# EAGLE schematic PR8004 (EAGLE 6.6.0)
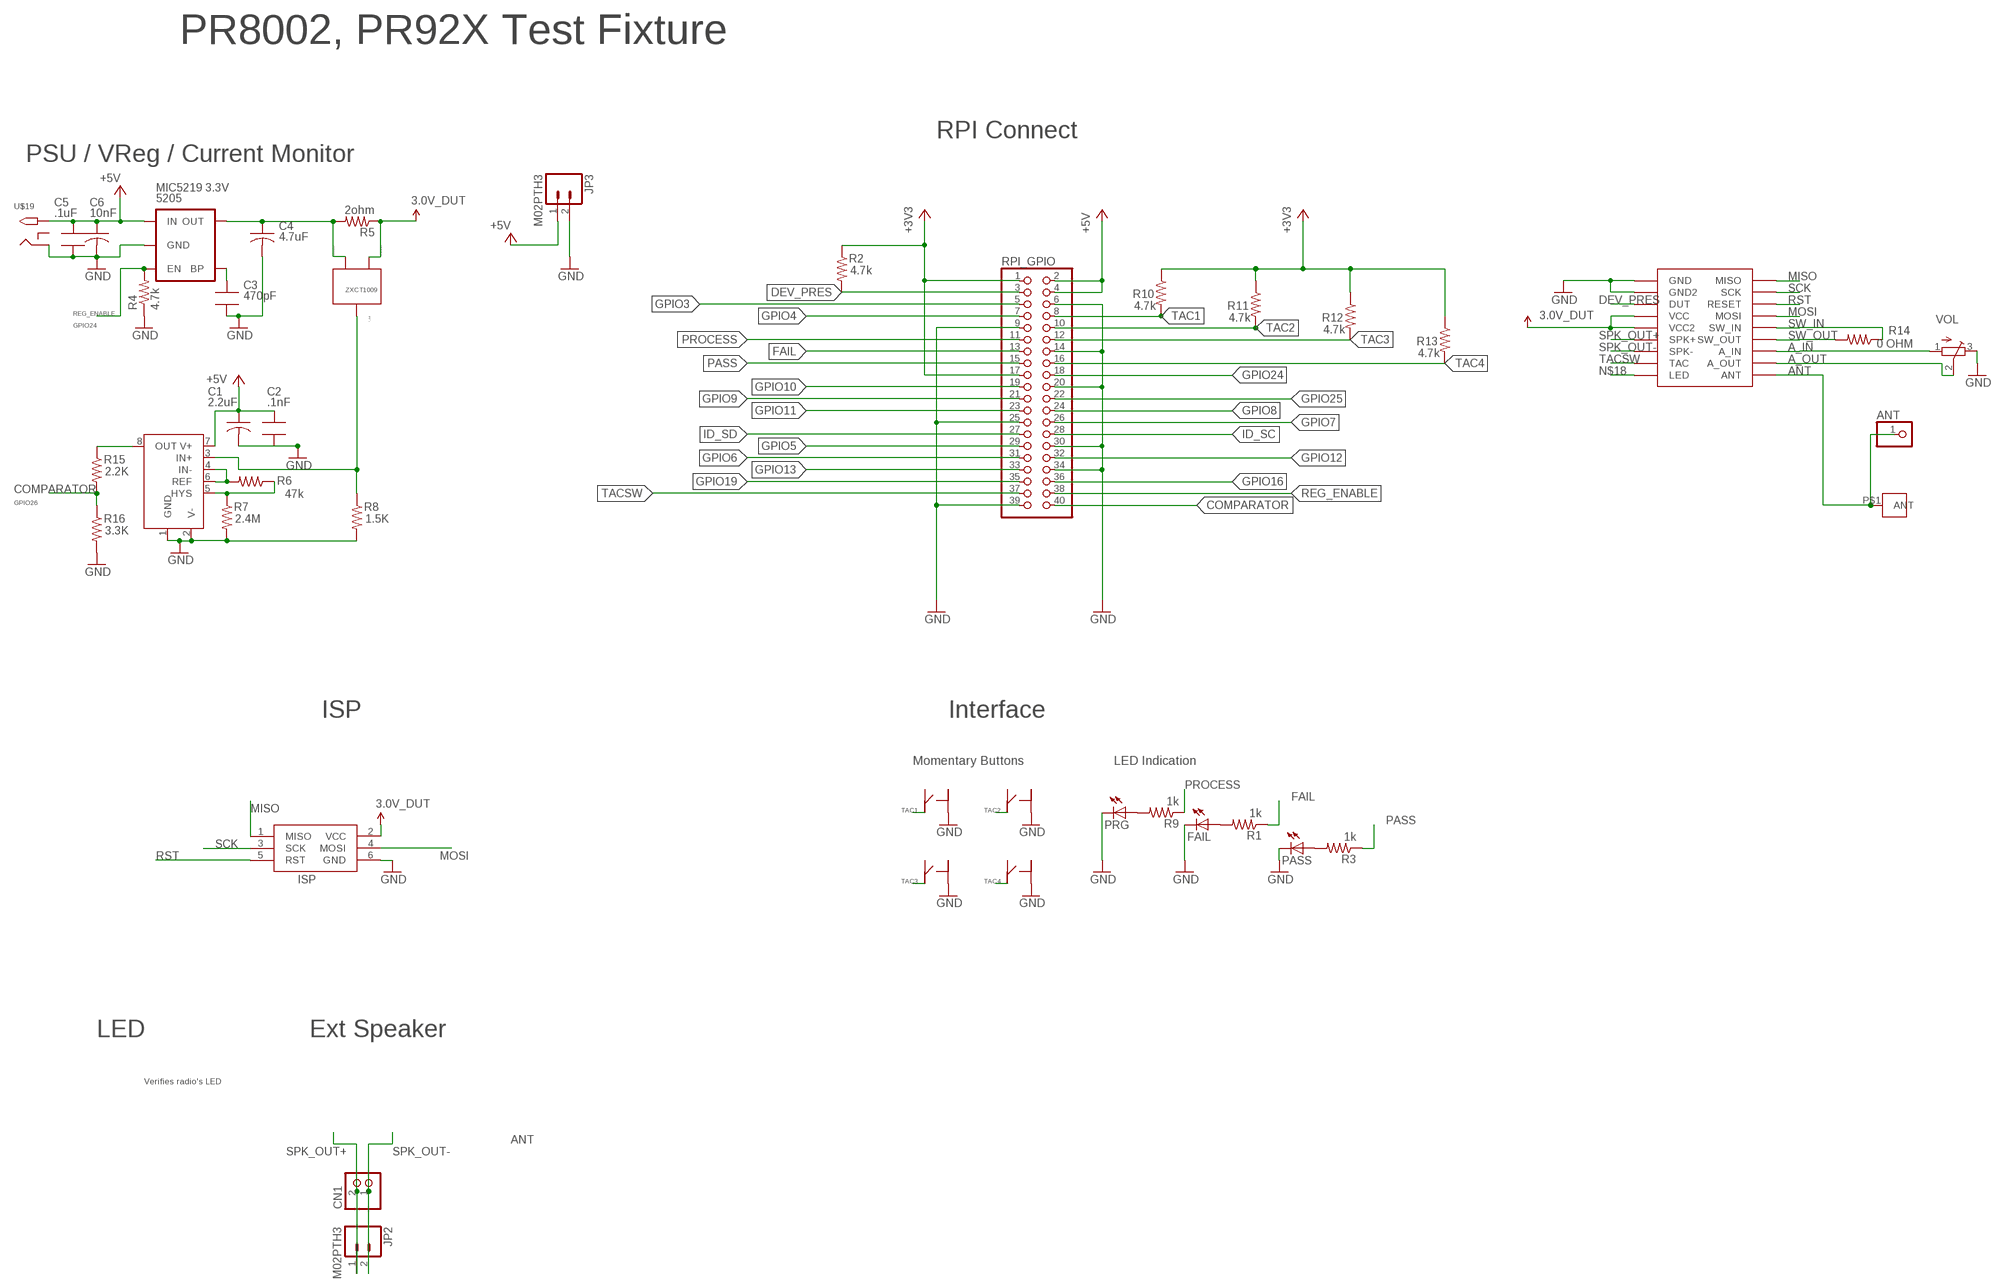
[diagram p0: schematic, sheet 1]

## Parts
5205  MIC5219 3.3V  V_REG_MIC52193.3V  [SOT23-5]
ANT  PINHD-1X1  [1X01]
C1  2.2uF  C-USC0805  [C0805]
C2  .1nF  C_SMT_0805_ADAFRUIT  [0805_ADAFRUIT]
C3  470pF  C_SMT_0805_ADAFRUIT  [0805_ADAFRUIT]
C4  4.7uF  C-USC0805  [C0805]
C5  .1uF  C_SMT_0805_ADAFRUIT  [0805_ADAFRUIT]
C6  10nF  C-USC0805  [C0805]
CN1  JST_2PIN-SMT-RA  [JST-B2B-PH-SM4-TB]
FAIL  LEDCHIP-LED0805  [CHIP-LED0805]
ISP  AVRISP-6  [AVRISP]
J1  M3_SCREW_POST  [M3_BOLT_HOLE]
JP2  M02PTH3  [1X02_LONGPADS]
JP3  M02PTH3  [1X02_LONGPADS]
PASS  LEDCHIP-LED0805  [CHIP-LED0805]
PRG  LEDCHIP-LED0805  [CHIP-LED0805]
R1  1k  R_SMT_0805_ADAFRUIT  [0805_ADAFRUIT]
R2  4.7k  R_SMT_0805_ADAFRUIT  [0805_ADAFRUIT]
R3  1k  R_SMT_0805_ADAFRUIT  [0805_ADAFRUIT]
R4  4.7k  R_SMT_0805_ADAFRUIT  [0805_ADAFRUIT]
R5  2ohm  R_SMT_0805_ADAFRUIT  [0805_ADAFRUIT]
R6  47k  R_SMT_0805_ADAFRUIT  [0805_ADAFRUIT]
R7  2.4M  R_SMT_0805_ADAFRUIT  [0805_ADAFRUIT]
R8  1.5K  R_SMT_0805_ADAFRUIT  [0805_ADAFRUIT]
R9  1k  R_SMT_0805_ADAFRUIT  [0805_ADAFRUIT]
R10  4.7k  R_SMT_0805_ADAFRUIT  [0805_ADAFRUIT]
R11  4.7k  R_SMT_0805_ADAFRUIT  [0805_ADAFRUIT]
R12  4.7k  R_SMT_0805_ADAFRUIT  [0805_ADAFRUIT]
R13  4.7k  R_SMT_0805_ADAFRUIT  [0805_ADAFRUIT]
R14  0 OHM  R_SMT_0805_ADAFRUIT  [0805_ADAFRUIT]
R15  2.2K  R_SMT_0805_ADAFRUIT  [0805_ADAFRUIT]
R16  3.3K  R_SMT_0805_ADAFRUIT  [0805_ADAFRUIT]
RPI_GPIO  PINHD-2X20  [2X20]
TSM931  TSM931  [MSOP8]
U$19  2.1MMJACKTHM  [PJ-102A]
U$20  C&K_PTS645  [C&K_PTS645_SMT]
U$22  C&K_PTS645  [C&K_PTS645_SMT]
U$23  C&K_PTS645  [C&K_PTS645_SMT]
U$24  C&K_PTS645  [C&K_PTS645_SMT]
U$26  PR9020_TESTPOINTS  [PR9020_TESTPOINTS]
VOL  TRIMPOTTC33X  [TC33X]
ZXCT  ZXCT1009  [SOT23]

## Nets
3.3V: ISP.2(VCC) R5.1 U$26.P$4(VCC) U$26.P$5(VCC2) ZXCT.1(VSENSE+) ; supply symbol labelled 3.0V_DUT
+3V3: R2.1 R10.1 R11.1 R12.1 R13.1 RPI_GPIO.1 RPI_GPIO.17
+5V: 5205.1(IN) C1.1 C2.1 C5.1 C6.1 JP3.1 RPI_GPIO.2 RPI_GPIO.4 TSM931.7(V+) U$19.TIP
A_IN: U$26.P$16(A_IN) VOL.1(A)
A_OUT: U$26.P$17(A_OUT) VOL.2(S)
ANT: ANT.1 J1.P$1(ANT) U$26.P$18(ANT)
COMPARATOR: R15.2 R16.1 RPI_GPIO.40
DEV_PRES: R2.2 RPI_GPIO.3 U$26.P$3(DUT)
FAIL: R1.1 RPI_GPIO.13
GND: 5205.2(GND) C1.2 C2.2 C3.2 C4.2 C5.2 C6.2 FAIL.C ISP.6(GND) JP3.2 PASS.C PRG.C R4.1 R7.2 R8.2 R16.2 RPI_GPIO.6 RPI_GPIO.9 RPI_GPIO.14 RPI_GPIO.20 RPI_GPIO.25 RPI_GPIO.30 RPI_GPIO.34 RPI_GPIO.39 TSM931.1(GND) TSM931.2(V-) U$19.RING U$20.P$2 U$22.P$2 U$23.P$2 U$24.P$2 U$26.P$1(GND) U$26.P$2(GND2) VOL.3(E)
GPIO3: RPI_GPIO.5
GPIO4: RPI_GPIO.7
GPIO5: RPI_GPIO.29
GPIO6: RPI_GPIO.31
GPIO7: RPI_GPIO.26
GPIO8: RPI_GPIO.24
GPIO9: RPI_GPIO.21
GPIO10: RPI_GPIO.19
GPIO11: RPI_GPIO.23
GPIO12: RPI_GPIO.32
GPIO13: RPI_GPIO.33
GPIO16: RPI_GPIO.36
GPIO19: RPI_GPIO.35
GPIO24: RPI_GPIO.18
GPIO25: RPI_GPIO.22
ID_SC: RPI_GPIO.28
ID_SD: RPI_GPIO.27
MISO: ISP.1(MISO) U$26.P$10(MISO)
MOSI: ISP.4(MOSI) U$26.P$13(MOSI)
N$1: R6.2 TSM931.4(IN-) TSM931.6(REF)
N$2: PRG.A R9.2
N$3: FAIL.A R1.2
N$4: PASS.A R3.2
N$6: R15.1 TSM931.8(OUT)
N$12: R8.1 TSM931.3(IN+) ZXCT.3(IOUT)
N$13: 5205.4(BP) C3.1
N$14: 5205.5(OUT) C4.1 R5.2 ZXCT.2(VSENSE-)
N$15: R6.1 R7.1 TSM931.5(HYS)
N$18: U$26.P$9(LED)
PASS: R3.1 RPI_GPIO.15
PROCESS: R9.1 RPI_GPIO.11
REG_ENABLE: 5205.3(EN) R4.2 RPI_GPIO.38
RST: ISP.5(RST) U$26.P$12(RESET)
SCK: ISP.3(SCK) U$26.P$11(SCK)
SPK_OUT+: CN1.2 JP2.1 U$26.P$6(SPK+)
SPK_OUT-: CN1.1 JP2.2 U$26.P$7(SPK-)
SW_IN: R14.2 U$26.P$14(SW_IN)
SW_OUT: R14.1 U$26.P$15(SW_OUT)
TAC1: R10.2 RPI_GPIO.8 U$20.P$4
TAC2: R11.2 RPI_GPIO.10 U$23.P$4
TAC3: R12.2 RPI_GPIO.12 U$22.P$4
TAC4: R13.2 RPI_GPIO.16 U$24.P$4
TACSW: RPI_GPIO.37 U$26.P$8(TAC)
Unconnected: U$19.RING_SW U$20.P$1 U$20.P$3 U$22.P$1 U$22.P$3 U$23.P$1 U$23.P$3 U$24.P$1 U$24.P$3

## Notes on the sheet
- PR8002, PR92X Test Fixture
- RPI Connect
- PSU / VReg / Current Monitor
- ZXCT1009
- GPIO24
- GPIO26
- ISP | Interface
- Momentary Buttons | LED Indication
- LED | Ext Speaker
- Verifies radio's LED

## Library data of the parts
5205 = SparkFun-PowerIC:V_REG_MIC5219: V_REG MIC5219 Standard 3.3V and 5V 500mA LDO voltage regulator in SOT-23 layout. Micrel part MIC5219. BP (by-pass) pin is used to lower output noise with 470pF cap, may be left open.; PROD_ID: VREG-5205-3.0
ANT = adafruit:PINHD-1X1: Pin header 1x1 for 0.1" spacing With round pins
C1 C4 C6 = adafruit:C-US: CAPACITOR, American symbol
C2 C3 C5 = PR_Parts_Library:C_SMT: SMT capacitor
CN1 = PR_Parts_Library:JST_2PIN: JST 2-pin connector; MFG_PN: B2B-PH-SM4-TB(LF)(SN)
FAIL PASS PRG = adafruit:LED: LED OSRAM: - CHIPLED LG R971, LG N971, LY N971, LG Q971, LY Q971, LO R971, LY R971 LH N974, LH R974 LS Q976, LO Q976, LY Q976 LO Q996 - Hyper CHIPLED LW Q18S LB Q993, LB Q99A, LB R99A - SideLED LS A670, LO A670, LY A670, LG A670, LP A670 LB A673, LV A673, LT A673, LW A673 LH A674 LY A675 LS A676, LA A676, LO A676, LY A676, LW A676 LS A679, LY A679, LG A679 - Hyper Micro SIDELED® LS Y876, LA Y876, LO Y876, LY Y876 LT Y87S - SmartLED LW L88C, LW L88S LB L89C, LB L89S, LG L890 LS L89K, LO L89K, LY L89K LS L896, LA L896, LO L896, LY L896 - TOPLED LS T670, LO T670, LY T670, LG T670, LP T670 LSG T670, LSP T670, LSY T670, LOP T670, LYG T670 LG T671, LOG T671, LSG T671 LB T673, LV T673, LT T673, LW T673 LH T674 LS T676, LA T676, LO T676, LY T676, LB T676, LH T676, LSB T676, LW T676 LB T67C, LV T67C, LT T67C, LS T67K, LO T67K, LY T67K, LW E67C LS E67B, LA E67B, LO E67B, LY E67B, LB E67C, LV E67C, LT E67C LW T67C LS T679, LY T679, LG T679 LS T770, LO T770, LY T770, LG T770, LP T770 LB T773, LV T773, LT T773, LW T773 LH T774 LS E675, LA E675, LY E675, LS T675 LS T776, LA T776, LO T776, LY T776, LB T776 LHGB T686 LT T68C, LB T68C - Hyper Mini TOPLED® LB M676 - Mini TOPLED Santana® LG M470 LS M47K, LO M47K, LY M47K Source: http://www.osram.convergy.de/
ISP = adafruit:AVRISP: AVR ISP HEADER Standard 6 pin header for AVR programming
J1 = PR_Parts_Library:M3_SCREW_POST: Antenna mounting hole for M3 screw.; MFG_PN: DNP
JP2 JP3 = SparkFun-Connectors:M02: Standard 2-pin 0.1" header. Use with - straight break away headers ( PRT-00116) - right angle break away headers (PRT-00553) - swiss pins (PRT-00743) - machine pins (PRT-00117) - female headers (PRT-00115) Molex polarized connector foot print use with: PRT-08233 with associated crimp pins and housings. 2.54_SCREWTERM for use with PRT-10571. 3.5mm Screw Terminal footprints for PRT-08084 5mm Screw Terminal footprints for use with PRT-08432
R1-R4 R6 R7 R9-R16 = PR_Parts_Library:R_SMT: SMT resistor
R5 = PR_Parts_Library:R_SMT: SMT resistor; POWER: .5W; TOL: 1%
R8 = PR_Parts_Library:R_SMT: SMT resistor; TOL: 1%
RPI_GPIO = adafruit:PINHD-2X20: PIN HEADER
TSM931 = PR_Parts_Library:TSM931
U$19 = adafruit:2.1MMJACK: 2.1mm x 5.5mm THM DC jack with internal switch. Digikey part #PJ-102A, 4UCON part #05537 2.1mm x 5.5mm SMT DC jack with internal switch. Digikey part #PJ-002A-SMT, 4UCON part #03267 By microbuilder.eu & adafruit.com
U$20 U$22-U$24 = PR_Parts_Library:C&K_PTS645: SWITCH TACTILE SPST-NO 0.05A 12V; MFG_PN: PTS645SM43SMTR92 LFS
U$26 = PR_Parts_Library:PR9020_TESTPOINTS
VOL = adafruit:TRIMPOT: SMT trimmer potentiometer part number TC33X http://www.ladyada.net/library/eagle
ZXCT = PR_Parts_Library:ZXCT1009

## Net classes
1 antenna: clearance 1.27 mm